# Altium schematic sheet fpga_power.SchDoc: FPGA Power
size A4; Organization: GPA Robotics; Revision: REV 0
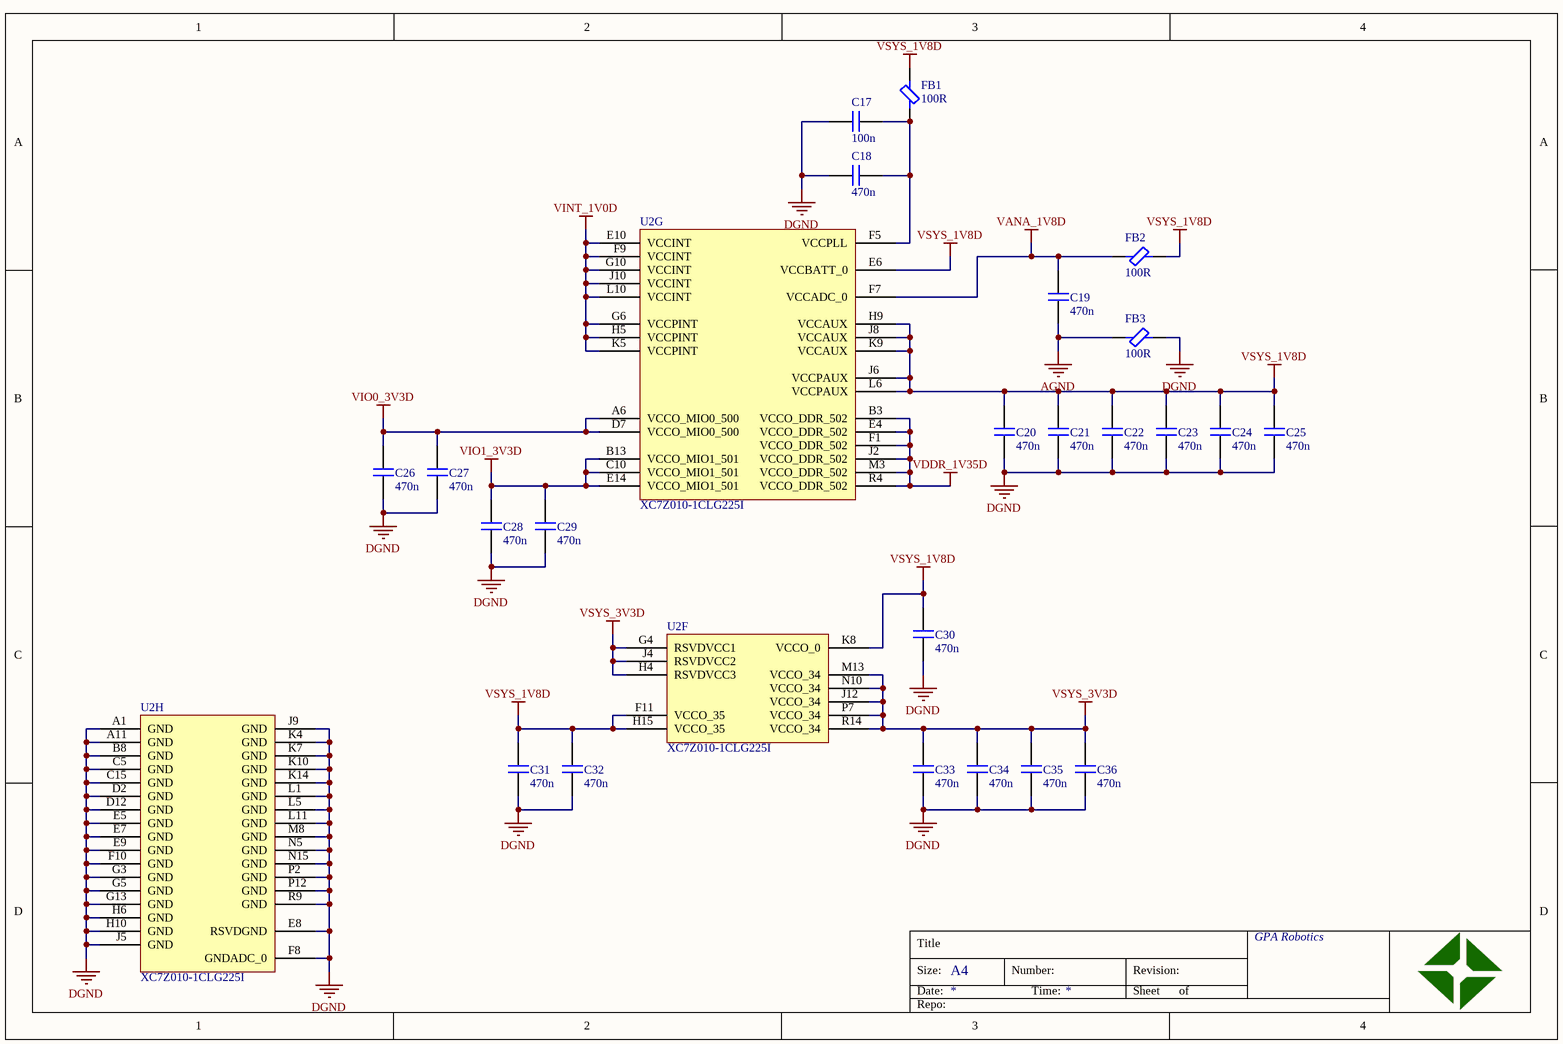
[diagram p0: fpga_power.SchDoc]

## Parts
C17  value 100n  [CAPC2012X11N]  (hidden comment: cap)
C18  value 470n  [CAPC1608X08N]  (hidden comment: cap)
C19  value 470n  [CAPC1608X08N]  (hidden comment: cap)
C20  value 470n  [CAPC1608X08N]  (hidden comment: cap)
C21  value 470n  [CAPC1608X08N]  (hidden comment: cap)
C22  value 470n  [CAPC1608X08N]  (hidden comment: cap)
C23  value 470n  [CAPC1608X08N]  (hidden comment: cap)
C24  value 470n  [CAPC1608X08N]  (hidden comment: cap)
C25  value 470n  [CAPC1608X08N]  (hidden comment: cap)
C26  value 470n  [CAPC1608X08N]  (hidden comment: cap)
C27  value 470n  [CAPC1608X08N]  (hidden comment: cap)
C28  value 470n  [CAPC1608X08N]  (hidden comment: cap)
C29  value 470n  [CAPC1608X08N]  (hidden comment: cap)
C30  value 470n  [CAPC1608X08N]  (hidden comment: cap)
C31  value 470n  [CAPC1608X08N]  (hidden comment: cap)
C32  value 470n  [CAPC1608X08N]  (hidden comment: cap)
C33  value 470n  [CAPC1608X08N]  (hidden comment: cap)
C34  value 470n  [CAPC1608X08N]  (hidden comment: cap)
C35  value 470n  [CAPC1608X08N]  (hidden comment: cap)
C36  value 470n  [CAPC1608X08N]  (hidden comment: cap)
FB1  value 100R  [INDC1005X06N]  (hidden comment: ferrite)
FB2  value 100R  [INDC1005X06N]  (hidden comment: ferrite)
FB3  value 100R  [INDC1005X06N]  (hidden comment: ferrite)
U2  XC7Z010-1CLG225I  [CLG225]  (parts F,G,H of 8)

## Nets
AGND: C19.1 FB3.2
DGND: C17.1 C18.1 C20.1 C21.1 C22.1 C23.1 C24.1 C25.1 C26.1 C27.1 C28.1 C29.1 C30.1 C31.1 C32.1 C33.1 C34.1 C35.1 C36.1 FB3.1 U2.A1(GND) U2.A11(GND) U2.B8(GND) U2.C5(GND) U2.C15(GND) U2.D2(GND) U2.D12(GND) U2.E5(GND) U2.E7(GND) U2.E8(RSVDGND) U2.E9(GND) U2.F8(GNDADC_0) U2.F10(GND) U2.G3(GND) U2.G5(GND) U2.G13(GND) U2.H6(GND) U2.H10(GND) U2.J5(GND) U2.J9(GND) U2.K4(GND) U2.K7(GND) U2.K10(GND) U2.K14(GND) U2.L1(GND) U2.L5(GND) U2.L11(GND) U2.M8(GND) U2.N5(GND) U2.N15(GND) U2.P2(GND) U2.P12(GND) U2.R9(GND)
VANA_1V8D: C19.2 FB2.2 U2.F7(VCCADC_0)
VDDR_1V35D: U2.B3(VCCO_DDR_502) U2.E4(VCCO_DDR_502) U2.F1(VCCO_DDR_502) U2.J2(VCCO_DDR_502) U2.M3(VCCO_DDR_502) U2.R4(VCCO_DDR_502)
VINT_1V0D: U2.E10(VCCINT) U2.F9(VCCINT) U2.G6(VCCPINT) U2.G10(VCCINT) U2.H5(VCCPINT) U2.J10(VCCINT) U2.K5(VCCPINT) U2.L10(VCCINT)
VIO0_3V3D: C26.2 C27.2 U2.A6(VCCO_MIO0_500) U2.D7(VCCO_MIO0_500)
VIO1_3V3D: C28.2 C29.2 U2.B13(VCCO_MIO1_501) U2.C10(VCCO_MIO1_501) U2.E14(VCCO_MIO1_501)
VSYS_1V8D: C20.2 C21.2 C22.2 C23.2 C24.2 C25.2 C30.2 C31.2 C32.2 FB1.2 FB2.1 U2.E6(VCCBATT_0) U2.F11(VCCO_35) U2.H9(VCCAUX) U2.H15(VCCO_35) U2.J6(VCCPAUX) U2.J8(VCCAUX) U2.K8(VCCO_0) U2.K9(VCCAUX) U2.L6(VCCPAUX)
VSYS_3V3D: C33.2 C34.2 C35.2 C36.2 U2.G4(RSVDVCC1) U2.H4(RSVDVCC3) U2.J4(RSVDVCC2) U2.J12(VCCO_34) U2.M13(VCCO_34) U2.N10(VCCO_34) U2.P7(VCCO_34) U2.R14(VCCO_34)
NetC17_2: C17.2 C18.2 FB1.1 U2.F5(VCCPLL)

## Notes on the sheet
- Title
- Size:
- Date:
- A4
- Number:
- Time:
- Revision:
- Sheet
- of
- Repo:

## Library data of the parts
C17-C36 = cap: Capacitor; voltage: *; type: *; #digikey: *; #mouser: *
FB1-FB3 = ferrite: Inductor; #digikey: *; #mouser: *
U2 = CMP-0382-00001-1: 667 MHz Zynq™-7000 AP SoC, 88 PS I/O, 54 FPGA I/O, 225-Ball BGA, Speed Grade 1, Industrial Grade, Pb-Free; LUTs: 17600; Extensible Block RAM (# 36Kb Blocks): 240 KB (60); Speed Grade: -1; Flip Flops: 35200; DatasheetVersion: v1.2; ComponentLink4Description: Package File; ComponentLink1URL: http://www.xilinx.com/support/documentation/data_sheets/ds190-Zynq-7000-Overview.pdf; ComponentLink5URL: http://www.xilinx.com/support/documentation/user_guides/ug865-Zynq-7000-Pkg-Pinout.pdf; ComponentLink5Description: Packaging and Pinout; PartNumber: XC7Z010-1CLG225I; PackageVersion: Rev 1.2, 02/2013; ComponentLink3Description: DC and AC Switching Characteristics; ComponentLink2URL: http://www.xilinx.com/support/documentation/user_guides/ug865-Zynq-7000-Pkg-Pinout.pdf; ComponentLink3URL: http://www.xilinx.com/support/documentation/data_sheets/ds187-XC7Z010-XC7Z020-Data-Sheet.pdf; ComponentLink6URL: http://www.xilinx.com/support/documentation/user_guides/ug483_7Series_PCB.pdf; ComponentLink2Description: Package Specification; PackageReference: CLG225; ComponentLink1Description: Datasheet; ComponentLink4URL: http://www.xilinx.com/support/packagefiles/z7packages/xc7z010clg225pkg.txt; Generic Part Number: XC7Z010; ComponentLink6Description: PCB and Layout Guide; Mounting Technology: Surface Mount; PackageDescription: Wire-Bond Chip-Scale BGA, Body 13 x 13 mm, 0.8 mm Pitch; Code_JEDEC: MO-275-HHAC-1; RoHS: Pb-Free